# EAGLE design board_IR (EAGLE 6.1)
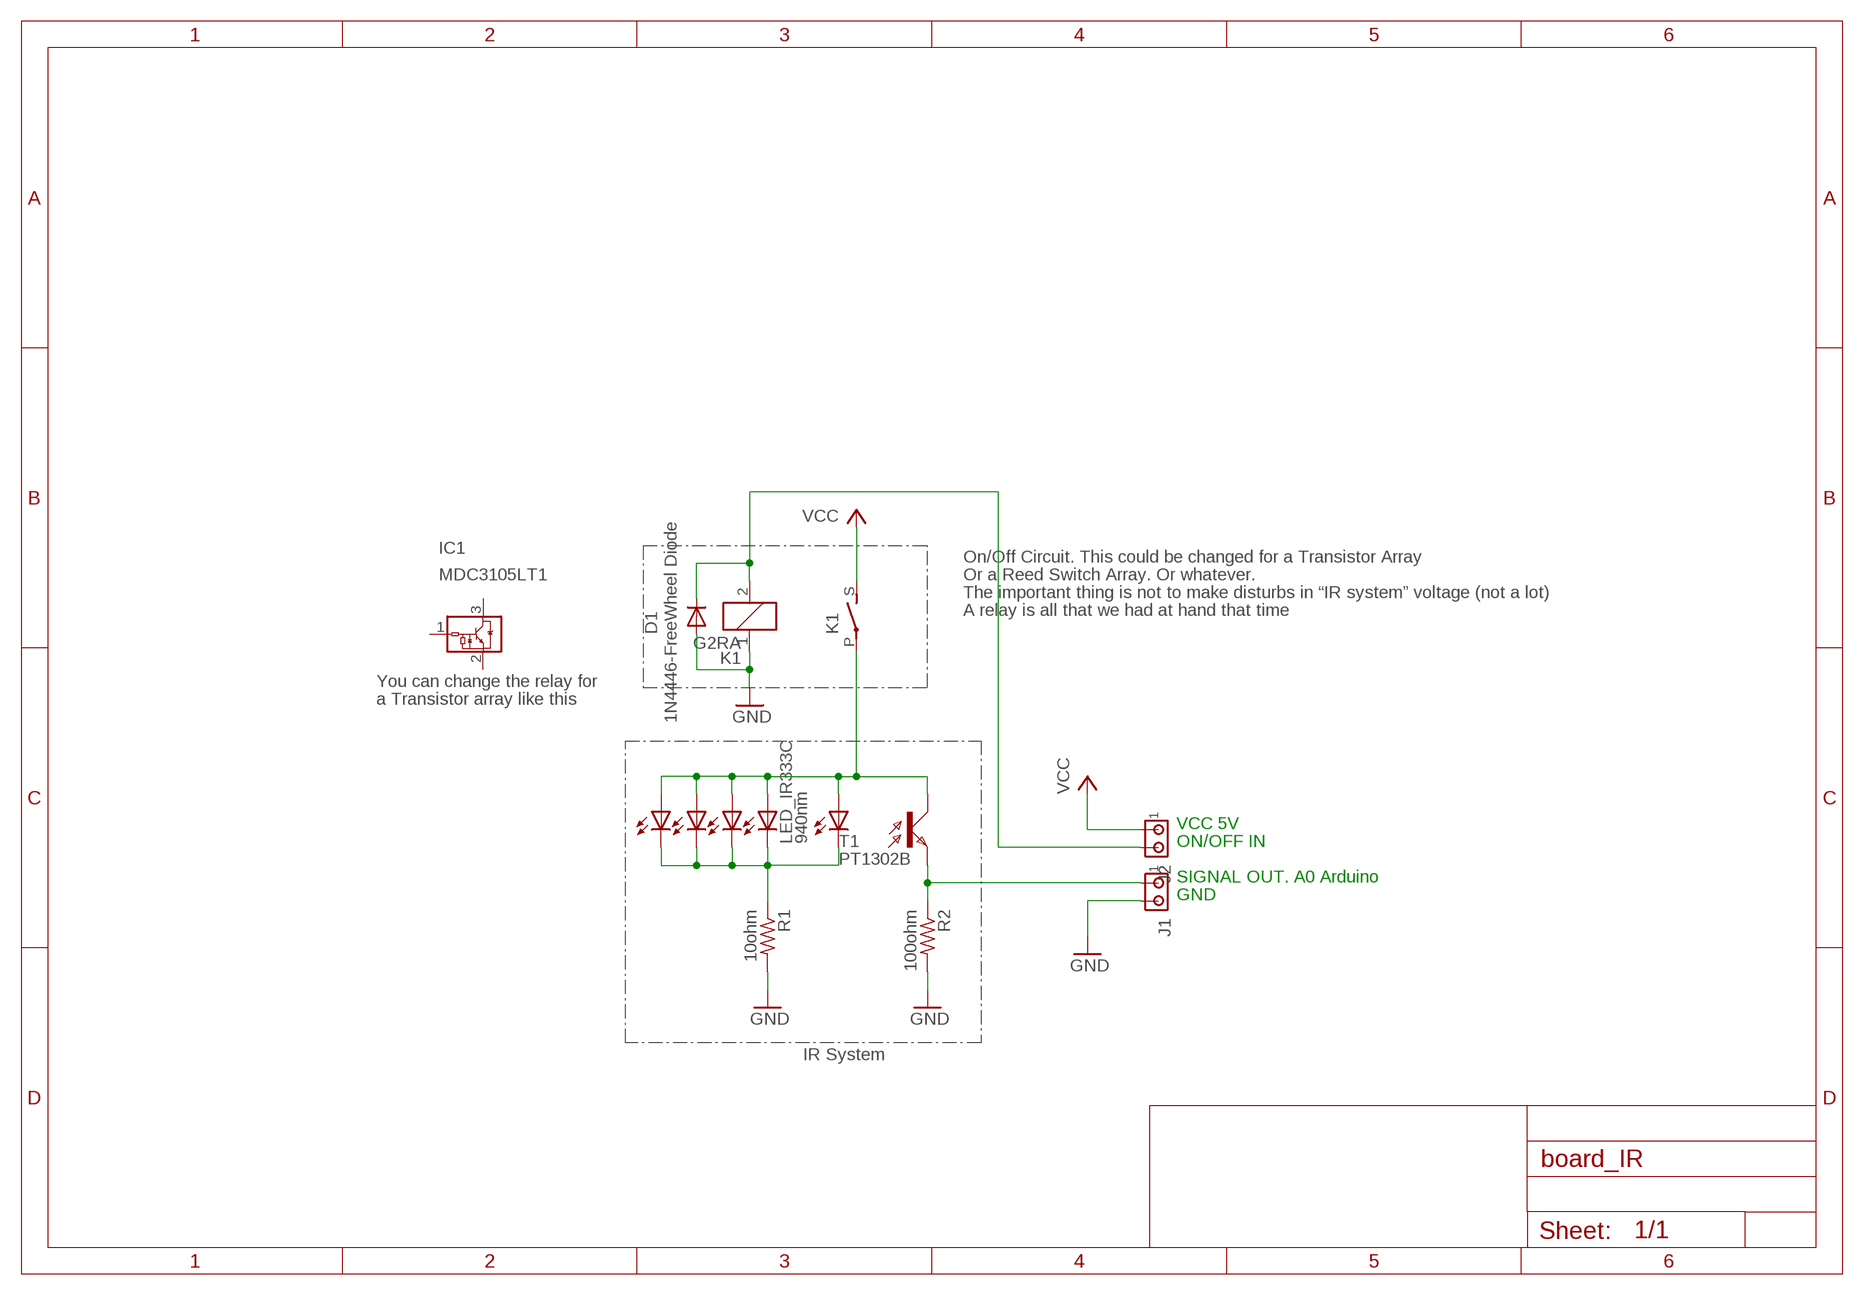
[diagram p0: schematic, sheet 1]

## Parts
D1  1N4446-FreeWheel Diode  1N4446  [DO35-10]
IC1  MDC3105LT1  [SOT23]
J1  MTA02-156  [1X2MTA]
J2  MTA02-156  [1X2MTA]
K1  G2RA  [G2RA]
LED_IR333C  940nm  LED5MM  [LED5MM]
LED_IR333C1  940nm  LED5MM  [LED5MM]
LED_IR333C2  940nm  LED5MM  [LED5MM]
LED_IR333C3  940nm  LED5MM  [LED5MM]
LED_IR333C4  940nm  LED5MM  [LED5MM]
R1  10ohm  R-US_0204/7  [0204/7]
R2  100ohm  R-US_0204/7  [0204/7]
T1  PT1302B  LPT80A  [LPT80A]

## Nets
GND: D1.A J1.2 K1.1 R1.2 R2.2
N$1: LED_IR333C1.K(C) LED_IR333C2.K(C) LED_IR333C3.K(C) LED_IR333C4.K(C) LED_IR333C.K(C) R1.1
N$2: J1.1 R2.1 T1.E
ON/OFF: D1.C J2.2 K1.2
SWITCH: K1.P(2:P) LED_IR333C1.A LED_IR333C2.A LED_IR333C3.A LED_IR333C4.A LED_IR333C.A T1.C
VCC: J2.1 K1.S(2:S)
Unconnected: IC1.1(VIN) IC1.2(GND) IC1.3(VOUT)

## Notes on the sheet
- On/Off Circuit. This could be changed for a Transistor Array
- Or a Reed Switch Array. Or whatever.
- The important thing is not to make disturbs in “IR system” voltage (not a lot)
- A relay is all that we had at hand that time
- You can change the relay for
- a Transistor array like this
- VCC 5V
- ON/OFF IN
- SIGNAL OUT. A0 Arduino
- GND
- IR System

## Library data of the parts
D1 = diode:1N4446: DIODE high speed (Philips)
IC1 = on-semiconductor:MDC3105LT1: Integrated Relay, Inductive Load Driver Sopurce: U6 OnSemi Inductive Load Driver MDC3105-D.PDF; MF: ON SEMICONDUCTOR; MPN: MDC3105LT1; OC_FARNELL: 1126459; OC_NEWARK: 16F6132
J1 J2 = con-amp:MTA02-156: AMP connector
K1 = relay:G2RA: RELAY 1 x norm. open, Omron; OC_FARNELL: unknown; OC_NEWARK: unknown
LED_IR333C LED_IR333C1-LED_IR333C4 = led:LED: LED OSRAM: - CHIPLED LG R971, LG N971, LY N971, LG Q971, LY Q971, LO R971, LY R971 LH N974, LH R974 LS Q976, LO Q976, LY Q976 LO Q996 - Hyper CHIPLED LW Q18S LB Q993, LB Q99A, LB R99A - SideLED LS A670, LO A670, LY A670, LG A670, LP A670 LB A673, LV A673, LT A673, LW A673 LH A674 LY A675 LS A676, LA A676, LO A676, LY A676, LW A676 LS A679, LY A679, LG A679 - Hyper Micro SIDELED® LS Y876, LA Y876, LO Y876, LY Y876 LT Y87S - SmartLED LW L88C, LW L88S LB L89C, LB L89S, LG L890 LS L89K, LO L89K, LY L89K LS L896, LA L896, LO L896, LY L896 - TOPLED LS T670, LO T670, LY T670, LG T670, LP T670 LSG T670, LSP T670, LSY T670, LOP T670, LYG T670 LG T671, LOG T671, LSG T671 LB T673, LV T673, LT T673, LW T673 LH T674 LS T676, LA T676, LO T676, LY T676, LB T676, LH T676, LSB T676, LW T676 LB T67C, LV T67C, LT T67C, LS T67K, LO T67K, LY T67K, LW E67C LS E67B, LA E67B, LO E67B, LY E67B, LB E67C, LV E67C, LT E67C LW T67C LS T679, LY T679, LG T679 LS T770, LO T770, LY T770, LG T770, LP T770 LB T773, LV T773, LT T773, LW T773 LH T774 LS E675, LA E675, LY E675, LS T675 LS T776, LA T776, LO T776, LY T776, LB T776 LHGB T686 LT T68C, LB T68C - Hyper Mini TOPLED® LB M676 - Mini TOPLED Santana® LG M470 LS M47K, LO M47K, LY M47K Source: http://www.osram.convergy.de LUXEON: - LUMILED® LXK2-PW12-R00, LXK2-PW12-S00, LXK2-PW14-U00, LXK2-PW14-V00 LXK2-PM12-R00, LXK2-PM12-S00, LXK2-PM14-U00 LXK2-PE12-Q00, LXK2-PE12-R00, LXK2-PE12-S00, LXK2-PE14-T00, LXK2-PE14-U00 LXK2-PB12-K00, LXK2-PB12-L00, LXK2-PB12-M00, LXK2-PB14-N00, LXK2-PB14-P00, LXK2-PB14-Q00 LXK2-PR12-L00, LXK2-PR12-M00, LXK2-PR14-Q00, LXK2-PR14-R00 LXK2-PD12-Q00, LXK2-PD12-R00, LXK2-PD12-S00 LXK2-PH12-R00, LXK2-PH12-S00 LXK2-PL12-P00, LXK2-PL12-Q00, LXK2-PL12-R00 Source: www.luxeon.com KINGBRIGHT: KA-3528ASYC Source: www.kingbright.com
R1 R2 = resistor:R-US_: RESISTOR, American symbol
T1 = opto-trans-siemens:LPT80A: PHOTO TRANSISTOR; OC_FARNELL: unknown; OC_NEWARK: unknown

## Board
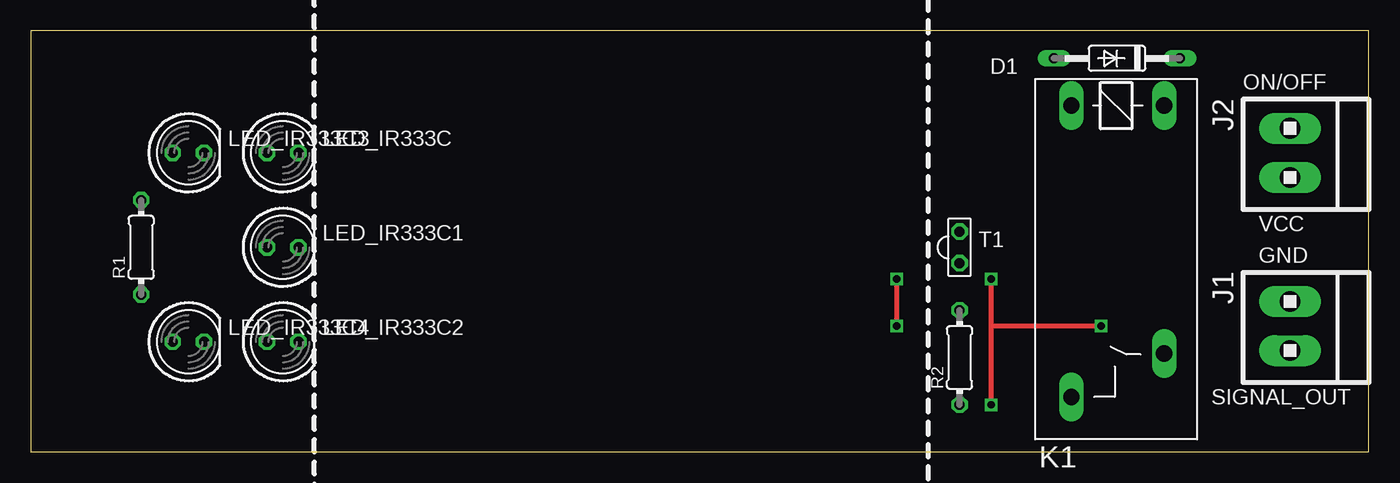
[diagram p1: board, top side]
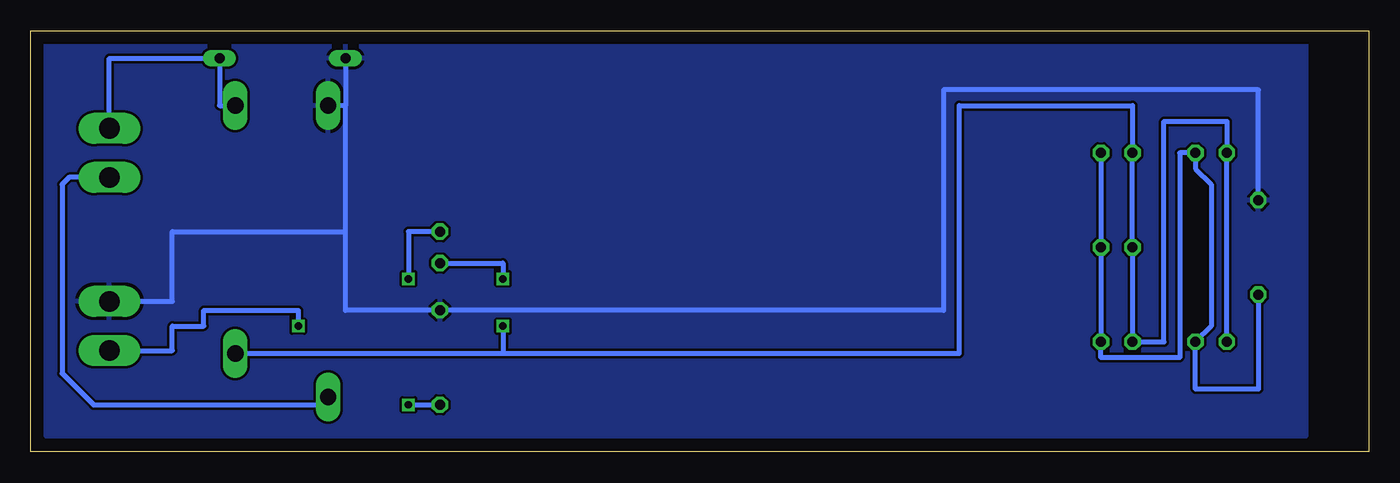
[diagram p2: board, bottom side, seen from below]

Size 107.93 x 33.96 mm. Coordinates in mm from the lower left corner, seen from the top.
Outline: 0,0 107.93,0 107.93,33.96 0,33.96 0,0
Copper layers (1*16): Top 0.035mm / dielectric 1.5mm / Bottom 0.035mm
Design rules: minimum track width 10mil, minimum drill 24mil, track to track 8mil, track to pad 8mil, pad to pad 8mil, via to via 8mil, smd to smd 8mil, copper to edge 40mil, drill to drill 8mil, minimum pad ring 10mil, minimum via ring 8mil, stop-mask expansion 4mil, vias tented up to drill 0mil, thermal gap 10mil

### Footprints (pad centres in the part's own frame; a part is rotated, then mirrored left to right if it is on the bottom)
DO35-10 = drill 0.813 long: A 5.08,0; C -5.08,0
SOT23 = smd 0.8 x 0.9: 1 -0.95,-1; 2 0.95,-1; 3 0,1
1X2MTA = drill 1.676 long: 1 1.981,0; 2 -1.981,0
G2RA = drill 1.321 long: 1 -3.81,-3.683; 2 -3.81,3.81; P 16.18,3.81; S 19.685,-3.683
LED5MM = drill 0.813 octagon: A -1.27,0; K 1.27,0
0204/7 = drill 0.813 octagon: 1 -3.81,0; 2 3.81,0
LPT80A = drill 0.813 octagon: C 0,-1.27; E 0,1.27

### Placement (x,y rotation side)
D1  87.63,31.75 180 top
IC1  -22.86,33.02 0 top  (outside the outline)
J1  101.6,10.16 270 top
J2  101.6,24.13 270 top
K1  87.63,24.13 270 top
LED_IR333C  20.32,24.13 0 top
LED_IR333C1  20.32,16.51 0 top
LED_IR333C2  20.32,8.89 0 top
LED_IR333C3  12.7,24.13 0 top
LED_IR333C4  12.7,8.89 0 top
R1  8.89,16.51 90 top
R2  74.93,7.62 90 top
T1  74.93,16.51 0 top

### Tracks (layer width: path | path; a pad name or v marks a point on that pad's centre or on a via)
GND
  Bottom 0.406: D1.A 82.55,27.94 | 82.55,27.94 K1.1 | 82.55,17.78 82.55,27.94 | J1.2 96.52,12.14 96.52,17.78 82.55,17.78 | R1.2 8.89,29.21 34.29,29.21 34.29,11.43 R2.2 82.55,11.43 82.55,17.78
  pour Bottom: 5.08,30.48 5.08,1.27 106.68,1.27 106.68,33.02 5.08,33.02
N$1
  Bottom 0.406: LED_IR333C.K LED_IR333C1.K LED_IR333C2.K 21.59,7.62 15.24,7.62 15.24,24.13 LED_IR333C3.K 13.97,22.86 12.7,21.59 12.7,10.16 LED_IR333C4.K 13.97,5.08 8.89,5.08 R1.1
N$2  (via drill 0.6)
  Top 0.406: v77.47,13.97 77.47,10.16 | 77.47,10.16 v77.47,3.81 | v86.36,10.16 77.47,10.16
  Bottom 0.406: T1.E 77.47,17.78 v77.47,13.97 | v77.47,3.81 R2.1 | J1.1 96.52,8.18 96.52,10.16 93.98,10.16 93.98,11.43 86.36,11.43 v86.36,10.16
ON/OFF
  Bottom 0.406: J2.2 101.6,31.75 D1.C 92.71,27.94 K1.2
SWITCH  (via drill 0.6)
  Top 0.406: v69.85,13.97 v69.85,10.16
  Bottom 0.406: LED_IR333C4.A LED_IR333C3.A 11.43,26.67 16.51,26.67 16.51,8.89 LED_IR333C2.A LED_IR333C1.A LED_IR333C.A 19.05,27.94 33.02,27.94 33.02,7.95 69.85,7.95 | K1.P 69.85,7.95 | T1.C 69.85,15.24 v69.85,13.97 | v69.85,10.16 69.85,7.95
VCC
  Bottom 0.406: J2.1 104.85,22.15 105.41,21.59 105.41,6.35 102.87,3.81 84.58,3.81 K1.S

### Text on the board
tPlace: ON/OFF | VCC | GND | SIGNAL_OUT